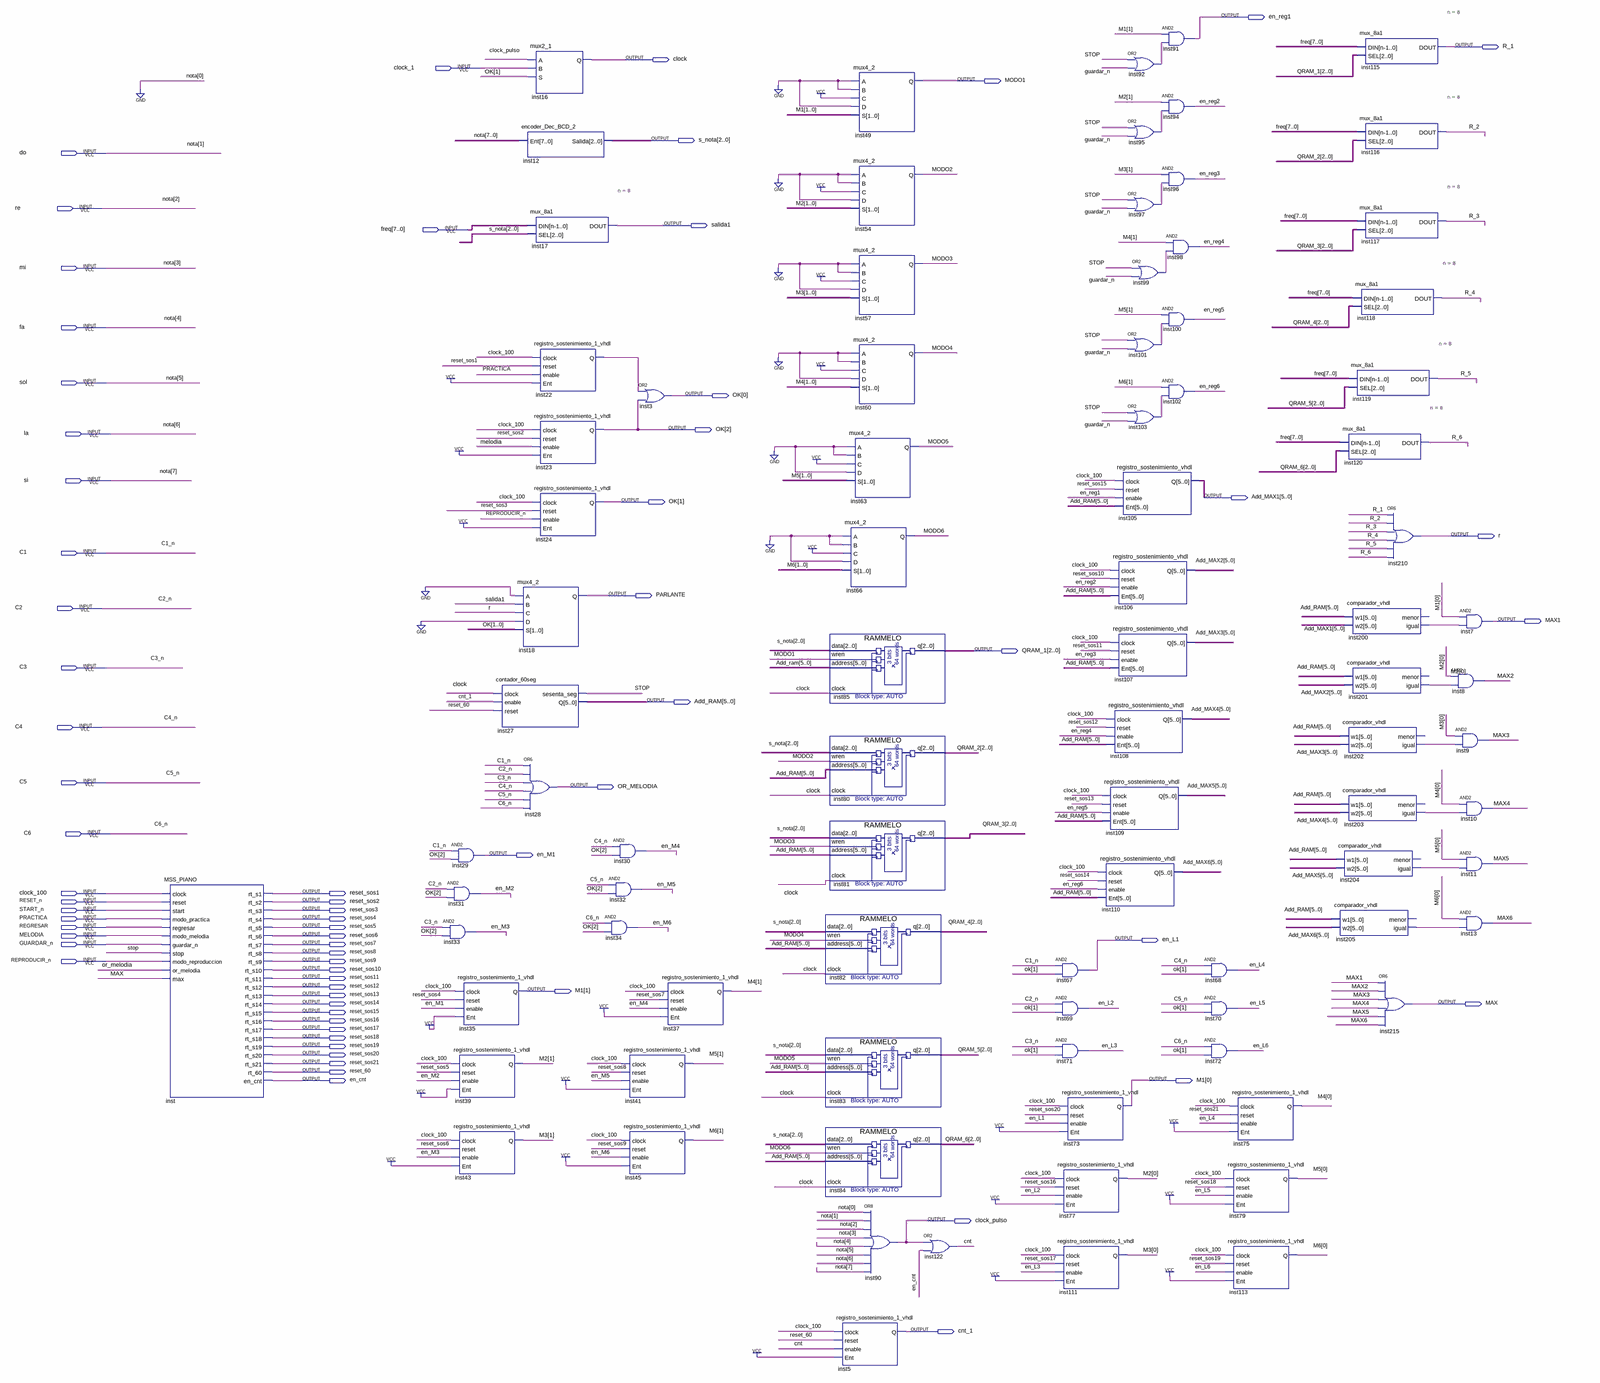
[diagram p0: schematic sheet, whole]
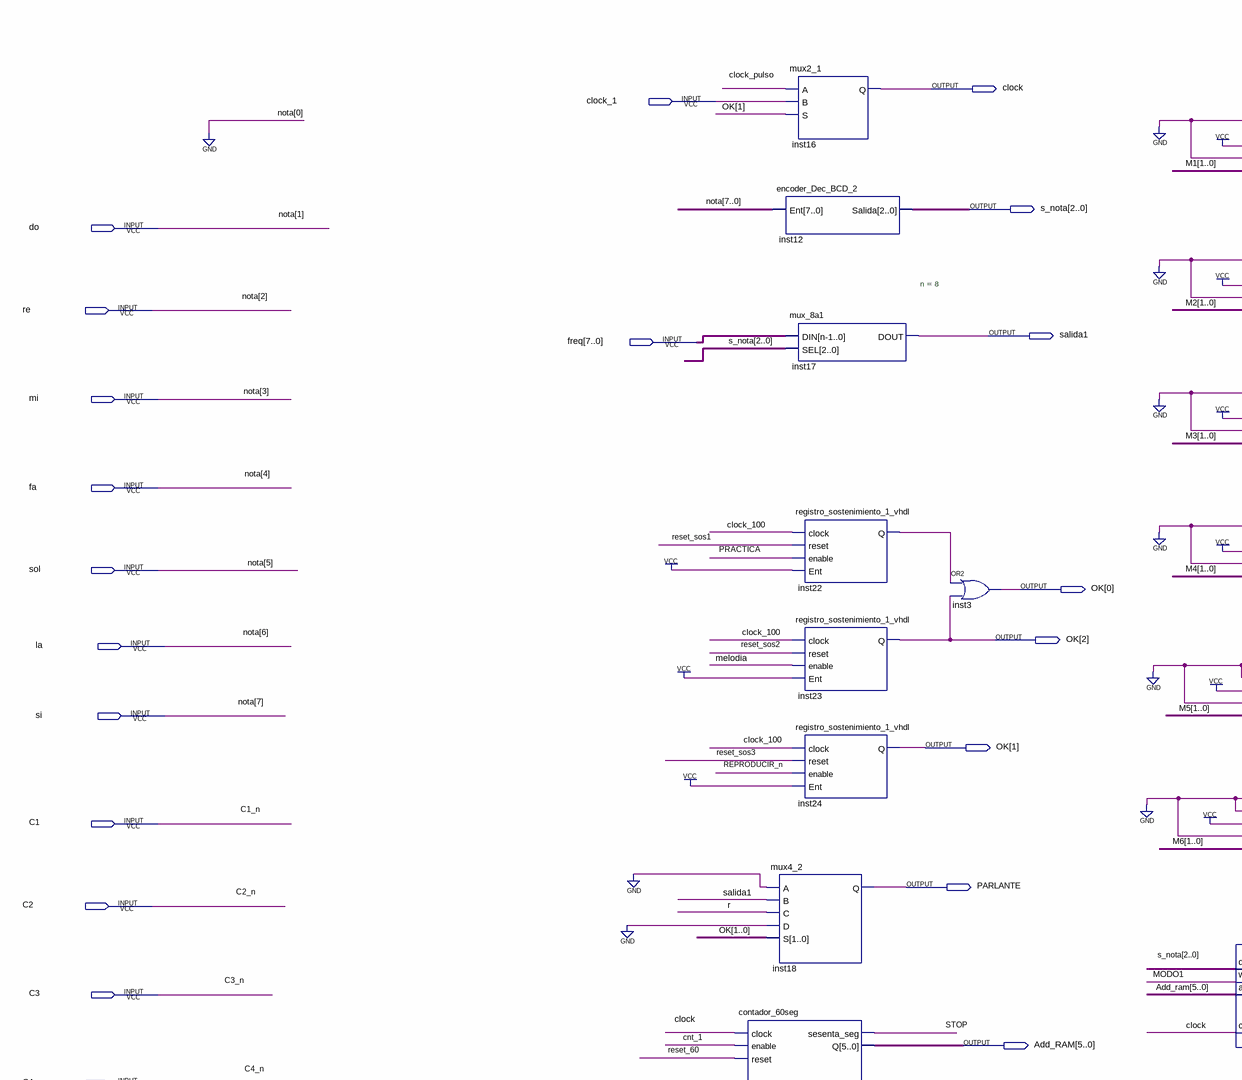
[diagram p1: schematic sheet, upper left part]
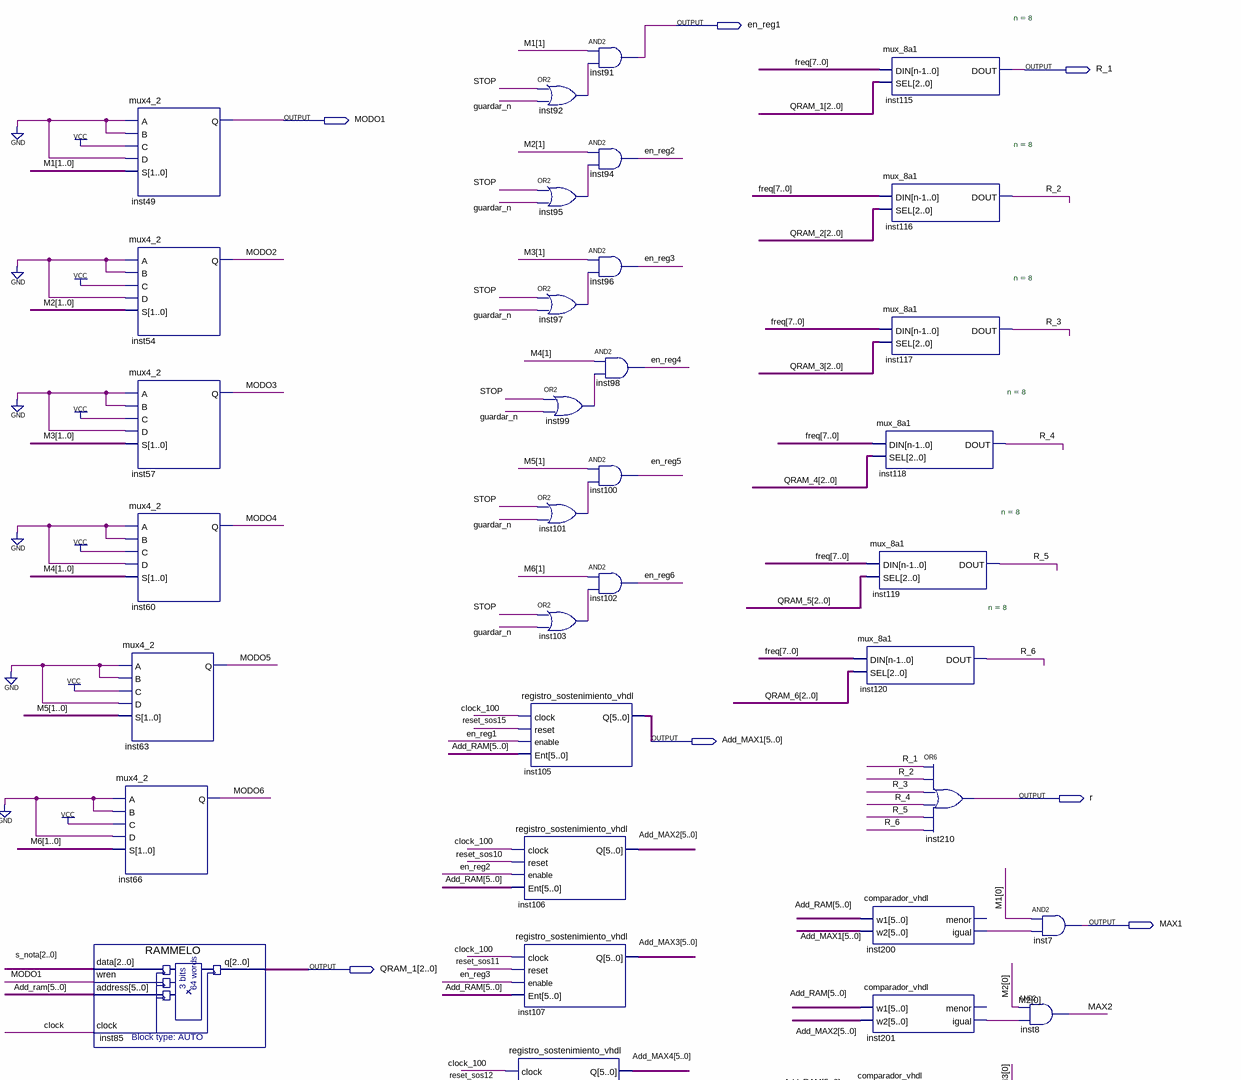
[diagram p2: schematic sheet, upper right part]
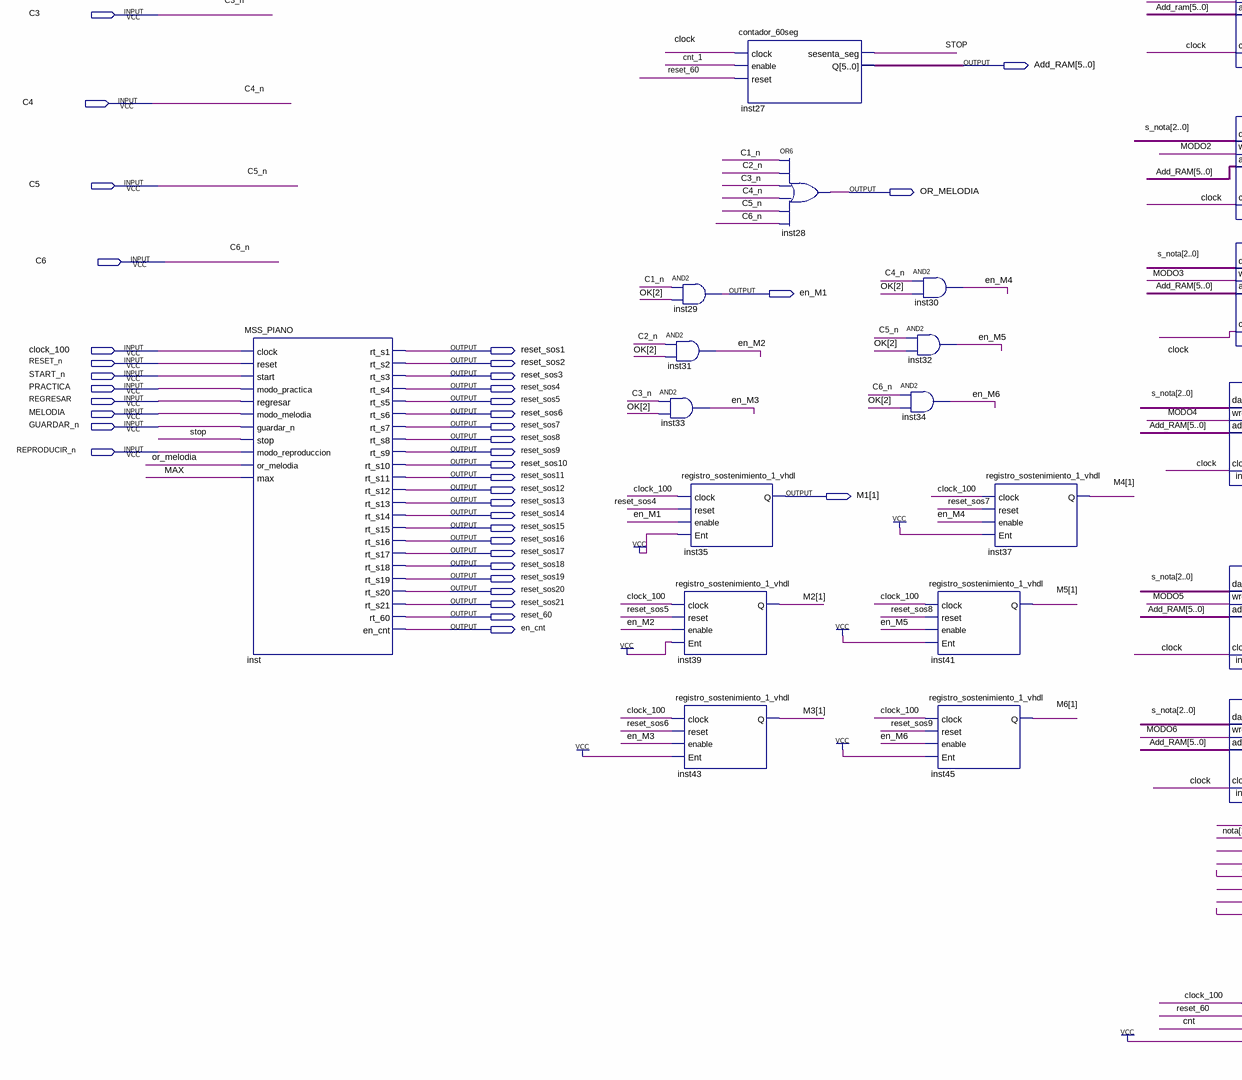
[diagram p3: schematic sheet, lower left part]
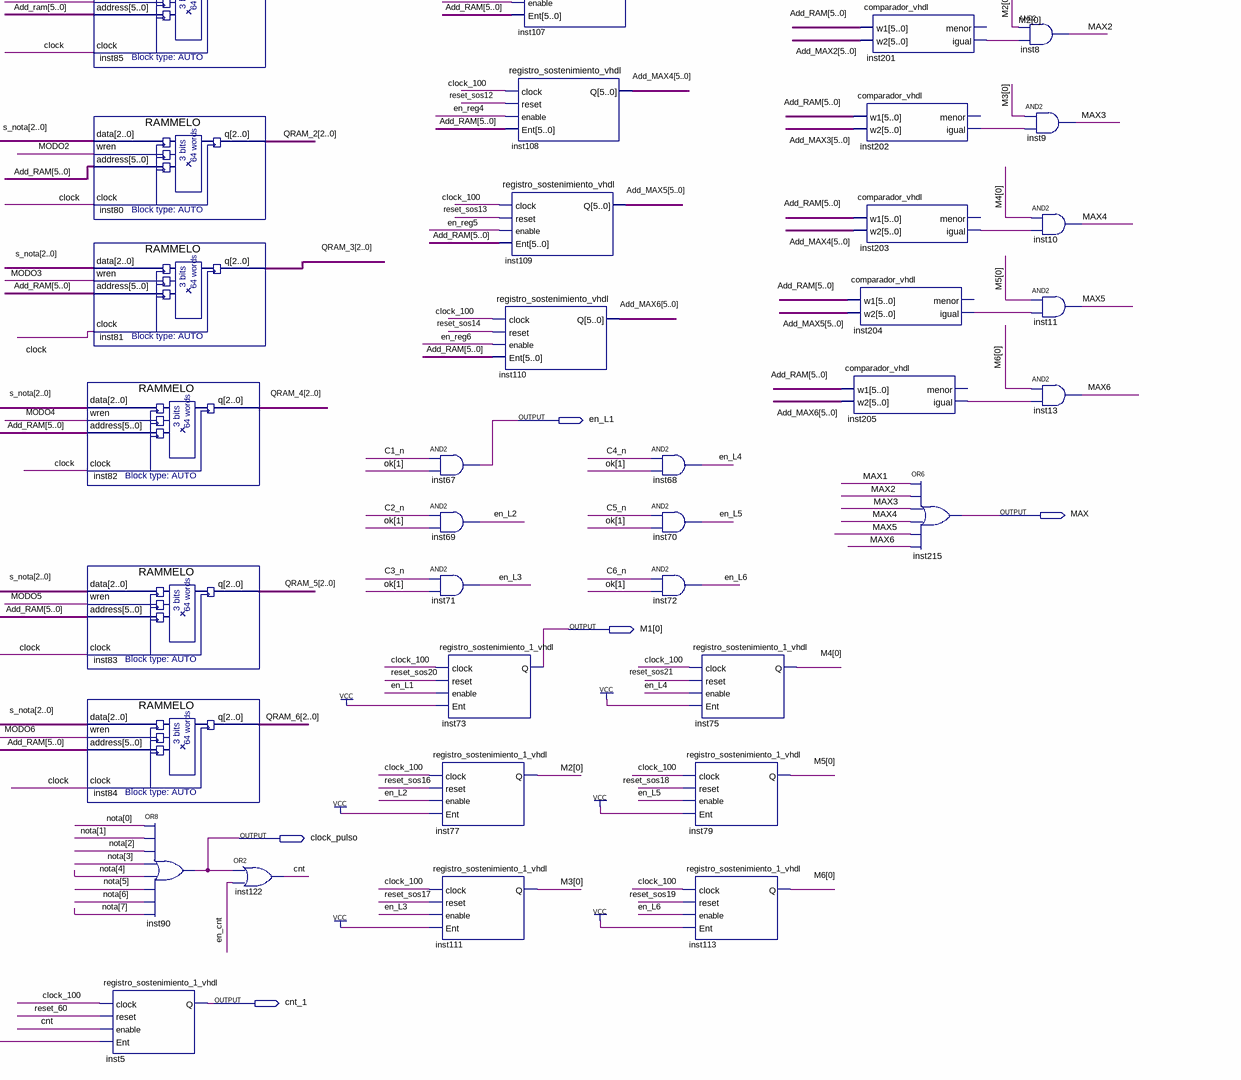
[diagram p4: schematic sheet, lower right part]
// Quartus schematic PIANO_WF.bdf as structural Verilog: 88 symbols, 69 pins
module PIANO_WF (
  input  clock_1,
  input  \do ,
  input  re,
  input  [7:0] freq,
  input  mi,
  input  fa,
  input  sol,
  input  la,
  input  si,
  input  C1,
  input  C2,
  input  C3,
  input  C4,
  input  C5,
  input  C6,
  input  clock_100,
  input  RESET_n,
  input  START_n,
  input  PRACTICA,
  input  REGRESAR,
  input  MELODIA,
  input  GUARDAR_n,
  input  REPRODUCIR_n,
  output en_reg1,
  output R_1,
  output clock,
  output MODO1,
  output [2:0] s_nota,
  output salida1,
  output [2:0] OK,
  output [5:0] Add_MAX1,
  output r,
  output PARLANTE,
  output MAX1,
  output [2:0] QRAM_1,
  output [5:0] Add_RAM,
  output OR_MELODIA,
  output en_M1,
  output reset_sos1,
  output reset_sos2,
  output reset_sos3,
  output reset_sos4,
  output reset_sos5,
  output reset_sos6,
  output en_L1,
  output reset_sos7,
  output reset_sos8,
  output reset_sos9,
  output reset_sos10,
  output reset_sos11,
  output reset_sos12,
  output [1:0] M1,
  output reset_sos13,
  output reset_sos14,
  output MAX,
  output reset_sos15,
  output reset_sos16,
  output reset_sos17,
  output reset_sos18,
  output reset_sos19,
  output reset_sos20,
  output reset_sos21,
  output reset_60,
  output en_cnt,
  output clock_pulso,
  output cnt_1
);

  wire cnt, en_L2, en_L3, en_L4, en_L5, en_L6, en_M2, en_M3, en_M4, en_M5, en_M6, en_reg2, en_reg3, en_reg4,
       en_reg5, en_reg6, inst22_q, inst92_out, inst95_out, inst97_out, inst99_out, inst101_out, inst103_out,
       inst200_igual, inst201_igual, inst202_igual, inst203_igual, inst204_igual, inst205_igual, MAX2, MAX3,
       MAX4, MAX5, MAX6, MODO2, MODO3, MODO4, MODO5, MODO6, R_2, R_3, R_4, R_5, R_6, STOP;
  wire [1:0] M2, M3, M4, M5, M6;
  wire [2:0] QRAM_2, QRAM_3, QRAM_4, QRAM_5, QRAM_6;
  wire [5:0] Add_MAX2, Add_MAX3, Add_MAX4, Add_MAX5, Add_MAX6;

  MSS_PIANO inst (
    .clock(clock_100), .reset(RESET_n), .start(START_n), .modo_practica(PRACTICA), .regresar(REGRESAR),
    .modo_melodia(MELODIA), .guardar_n(GUARDAR_n), .stop(STOP), .modo_reproduccion(REPRODUCIR_n),
    .or_melodia(OR_MELODIA), .max(MAX), .rt_s1(reset_sos1), .rt_s2(reset_sos2), .rt_s3(reset_sos3),
    .rt_s4(reset_sos4), .rt_s5(reset_sos5), .rt_s6(reset_sos6), .rt_s7(reset_sos7), .rt_s8(reset_sos8),
    .rt_s9(reset_sos9), .rt_s10(reset_sos10), .rt_s11(reset_sos11), .rt_s12(reset_sos12),
    .rt_s13(reset_sos13), .rt_s14(reset_sos14), .rt_s15(reset_sos15), .rt_s16(reset_sos16),
    .rt_s17(reset_sos17), .rt_s18(reset_sos18), .rt_s19(reset_sos19), .rt_s20(reset_sos20),
    .rt_s21(reset_sos21), .rt_60(reset_60), .en_cnt(en_cnt));
  and inst33 (en_M3, C3, OK[2]);
  and inst29 (en_M1, C1, OK[2]);
  and inst31 (en_M2, C2, OK[2]);
  registro_sostenimiento_1_vhdl inst35 (.clock(clock_100), .reset(reset_sos4), .enable(en_M1), .Ent(1'b1), .Q(M1[1]));
  registro_sostenimiento_1_vhdl inst39 (.clock(clock_100), .reset(reset_sos5), .enable(en_M2), .Ent(1'b1), .Q(M2[1]));
  registro_sostenimiento_1_vhdl inst43 (.clock(clock_100), .reset(reset_sos6), .enable(en_M3), .Ent(1'b1), .Q(M3[1]));
  contador_60seg inst27 (.clock(clock), .enable(cnt_1), .reset(reset_60), .sesenta_seg(STOP), .Q(Add_RAM));
  mux2_1 inst16 (.A(clock_pulso), .B(clock_1), .S(OK[1]), .Q(clock));
  encoder_Dec_BCD_2 inst12 (.Ent({si, la, sol, fa, mi, re, \do , 1'b0}), .Salida(s_nota));
  mux_8a1 #(.n(8)) inst17 (.DIN(freq), .SEL(s_nota), .DOUT(salida1));
  registro_sostenimiento_1_vhdl inst22 (
    .clock(clock_100), .reset(reset_sos1), .enable(PRACTICA), .Ent(1'b1), .Q(inst22_q));
  registro_sostenimiento_1_vhdl inst23 (.clock(clock_100), .reset(reset_sos2), .enable(MELODIA), .Ent(1'b1), .Q(OK[2]));
  registro_sostenimiento_1_vhdl inst24 (
    .clock(clock_100), .reset(reset_sos3), .enable(REPRODUCIR_n), .Ent(1'b1), .Q(OK[1]));
  mux4_2 inst18 (.A(1'b0), .B(salida1), .C(r), .D(1'b0), .S(OK[1:0]), .Q(PARLANTE));
  or inst28 (OR_MELODIA, C1, C2, C3, C4, C5, C6);
  and inst30 (en_M4, C4, OK[2]);
  and inst32 (en_M5, C5, OK[2]);
  and inst34 (en_M6, C6, OK[2]);
  or inst3 (OK[0], inst22_q, OK[2]);
  registro_sostenimiento_1_vhdl inst41 (.clock(clock_100), .reset(reset_sos8), .enable(en_M5), .Ent(1'b1), .Q(M5[1]));
  registro_sostenimiento_1_vhdl inst45 (.clock(clock_100), .reset(reset_sos9), .enable(en_M6), .Ent(1'b1), .Q(M6[1]));
  registro_sostenimiento_1_vhdl inst37 (.clock(clock_100), .reset(reset_sos7), .enable(en_M4), .Ent(1'b1), .Q(M4[1]));
  mux4_2 inst49 (.A(1'b0), .B(1'b0), .C(1'b1), .D(1'b0), .S(M1), .Q(MODO1));
  mux4_2 inst54 (.A(1'b0), .B(1'b0), .C(1'b1), .D(1'b0), .S(M2), .Q(MODO2));
  mux4_2 inst57 (.A(1'b0), .B(1'b0), .C(1'b1), .D(1'b0), .S(M3), .Q(MODO3));
  mux4_2 inst60 (.A(1'b0), .B(1'b0), .C(1'b1), .D(1'b0), .S(M4), .Q(MODO4));
  mux4_2 inst63 (.A(1'b0), .B(1'b0), .C(1'b1), .D(1'b0), .S(M5), .Q(MODO5));
  mux4_2 inst66 (.A(1'b0), .B(1'b0), .C(1'b1), .D(1'b0), .S(M6), .Q(MODO6));
  RAMMELO inst85 (.data(s_nota), .wren(MODO1), .address(Add_RAM), .clock(clock), .q(QRAM_1));
  RAMMELO inst80 (.data(s_nota), .wren(MODO2), .address(Add_RAM), .clock(clock), .q(QRAM_2));
  RAMMELO inst81 (.data(s_nota), .wren(MODO3), .address(Add_RAM), .clock(clock), .q(QRAM_3));
  RAMMELO inst82 (.data(s_nota), .wren(MODO4), .address(Add_RAM), .clock(clock), .q(QRAM_4));
  RAMMELO inst83 (.data(s_nota), .wren(MODO5), .address(Add_RAM), .clock(clock), .q(QRAM_5));
  RAMMELO inst84 (.data(s_nota), .wren(MODO6), .address(Add_RAM), .clock(clock), .q(QRAM_6));
  registro_sostenimiento_1_vhdl inst5 (.clock(clock_100), .reset(reset_60), .enable(cnt), .Ent(1'b1), .Q(cnt_1));
  or inst90 (clock_pulso, 1'b0, \do , re, mi, fa, sol, la, si);
  or inst122 (cnt, clock_pulso, en_cnt);
  and inst67 (en_L1, C1, OK[1]);
  and inst69 (en_L2, C2, OK[1]);
  and inst71 (en_L3, C3, OK[1]);
  registro_sostenimiento_1_vhdl inst77 (.clock(clock_100), .reset(reset_sos16), .enable(en_L2), .Ent(1'b1), .Q(M2[0]));
  registro_sostenimiento_1_vhdl inst111 (.clock(clock_100), .reset(reset_sos17), .enable(en_L3), .Ent(1'b1), .Q(M3[0]));
  registro_sostenimiento_1_vhdl inst73 (.clock(clock_100), .reset(reset_sos20), .enable(en_L1), .Ent(1'b1), .Q(M1[0]));
  registro_sostenimiento_vhdl inst105 (
    .clock(clock_100), .reset(reset_sos15), .enable(en_reg1), .Ent(Add_RAM), .Q(Add_MAX1));
  registro_sostenimiento_vhdl inst106 (
    .clock(clock_100), .reset(reset_sos10), .enable(en_reg2), .Ent(Add_RAM), .Q(Add_MAX2));
  registro_sostenimiento_vhdl inst107 (
    .clock(clock_100), .reset(reset_sos11), .enable(en_reg3), .Ent(Add_RAM), .Q(Add_MAX3));
  registro_sostenimiento_vhdl inst108 (
    .clock(clock_100), .reset(reset_sos12), .enable(en_reg4), .Ent(Add_RAM), .Q(Add_MAX4));
  registro_sostenimiento_vhdl inst109 (
    .clock(clock_100), .reset(reset_sos13), .enable(en_reg5), .Ent(Add_RAM), .Q(Add_MAX5));
  registro_sostenimiento_vhdl inst110 (
    .clock(clock_100), .reset(reset_sos14), .enable(en_reg6), .Ent(Add_RAM), .Q(Add_MAX6));
  or inst92 (inst92_out, STOP, GUARDAR_n);
  or inst95 (inst95_out, STOP, GUARDAR_n);
  or inst97 (inst97_out, STOP, GUARDAR_n);
  or inst99 (inst99_out, STOP, GUARDAR_n);
  or inst101 (inst101_out, STOP, GUARDAR_n);
  or inst103 (inst103_out, STOP, GUARDAR_n);
  and inst91 (en_reg1, M1[1], inst92_out);
  and inst94 (en_reg2, M2[1], inst95_out);
  and inst96 (en_reg3, M3[1], inst97_out);
  and inst98 (en_reg4, M4[1], inst99_out);
  and inst100 (en_reg5, M5[1], inst101_out);
  and inst102 (en_reg6, M6[1], inst103_out);
  and inst68 (en_L4, C4, OK[1]);
  and inst70 (en_L5, C5, OK[1]);
  and inst72 (en_L6, C6, OK[1]);
  registro_sostenimiento_1_vhdl inst79 (.clock(clock_100), .reset(reset_sos18), .enable(en_L5), .Ent(1'b1), .Q(M5[0]));
  registro_sostenimiento_1_vhdl inst113 (.clock(clock_100), .reset(reset_sos19), .enable(en_L6), .Ent(1'b1), .Q(M6[0]));
  registro_sostenimiento_1_vhdl inst75 (.clock(clock_100), .reset(reset_sos21), .enable(en_L4), .Ent(1'b1), .Q(M4[0]));
  mux_8a1 #(.n(8)) inst115 (.DIN(freq), .SEL(QRAM_1), .DOUT(R_1));
  mux_8a1 #(.n(8)) inst116 (.DIN(freq), .SEL(QRAM_2), .DOUT(R_2));
  mux_8a1 #(.n(8)) inst117 (.DIN(freq), .SEL(QRAM_3), .DOUT(R_3));
  mux_8a1 #(.n(8)) inst118 (.DIN(freq), .SEL(QRAM_4), .DOUT(R_4));
  mux_8a1 #(.n(8)) inst119 (.DIN(freq), .SEL(QRAM_5), .DOUT(R_5));
  mux_8a1 #(.n(8)) inst120 (.DIN(freq), .SEL(QRAM_6), .DOUT(R_6));
  comparador_vhdl inst200 (.w1(Add_RAM), .w2(Add_MAX1), .igual(inst200_igual));  // open: menor
  comparador_vhdl inst201 (.w1(Add_RAM), .w2(Add_MAX2), .igual(inst201_igual));  // open: menor
  comparador_vhdl inst202 (.w1(Add_RAM), .w2(Add_MAX3), .igual(inst202_igual));  // open: menor
  comparador_vhdl inst203 (.w1(Add_RAM), .w2(Add_MAX4), .igual(inst203_igual));  // open: menor
  comparador_vhdl inst204 (.w1(Add_RAM), .w2(Add_MAX5), .igual(inst204_igual));  // open: menor
  comparador_vhdl inst205 (.w1(Add_RAM), .w2(Add_MAX6), .igual(inst205_igual));  // open: menor
  or inst210 (r, R_1, R_2, R_3, R_4, R_5, R_6);
  or inst215 (MAX, MAX1, MAX2, MAX3, MAX4, MAX5, MAX6);
  and inst7 (MAX1, M1[0], inst200_igual);
  and inst8 (MAX2, M2[0], inst201_igual);
  and inst9 (MAX3, M3[0], inst202_igual);
  and inst10 (MAX4, M4[0], inst203_igual);
  and inst11 (MAX5, M5[0], inst204_igual);
  and inst13 (MAX6, M6[0], inst205_igual);

  // Other names for the same wires on the sheet: C1_n = C1; C2_n = C2; C3_n = C3; C4_n = C4; C5_n = C5; C6_n = C6;
  //   nota[7:1] = {si, la, sol, fa, mi, re, \do }
endmodule
